# Altium schematic sheet POWER_BATT_REV2.SchDoc
size A4; SheetNumber: 2; SheetTotal: 11
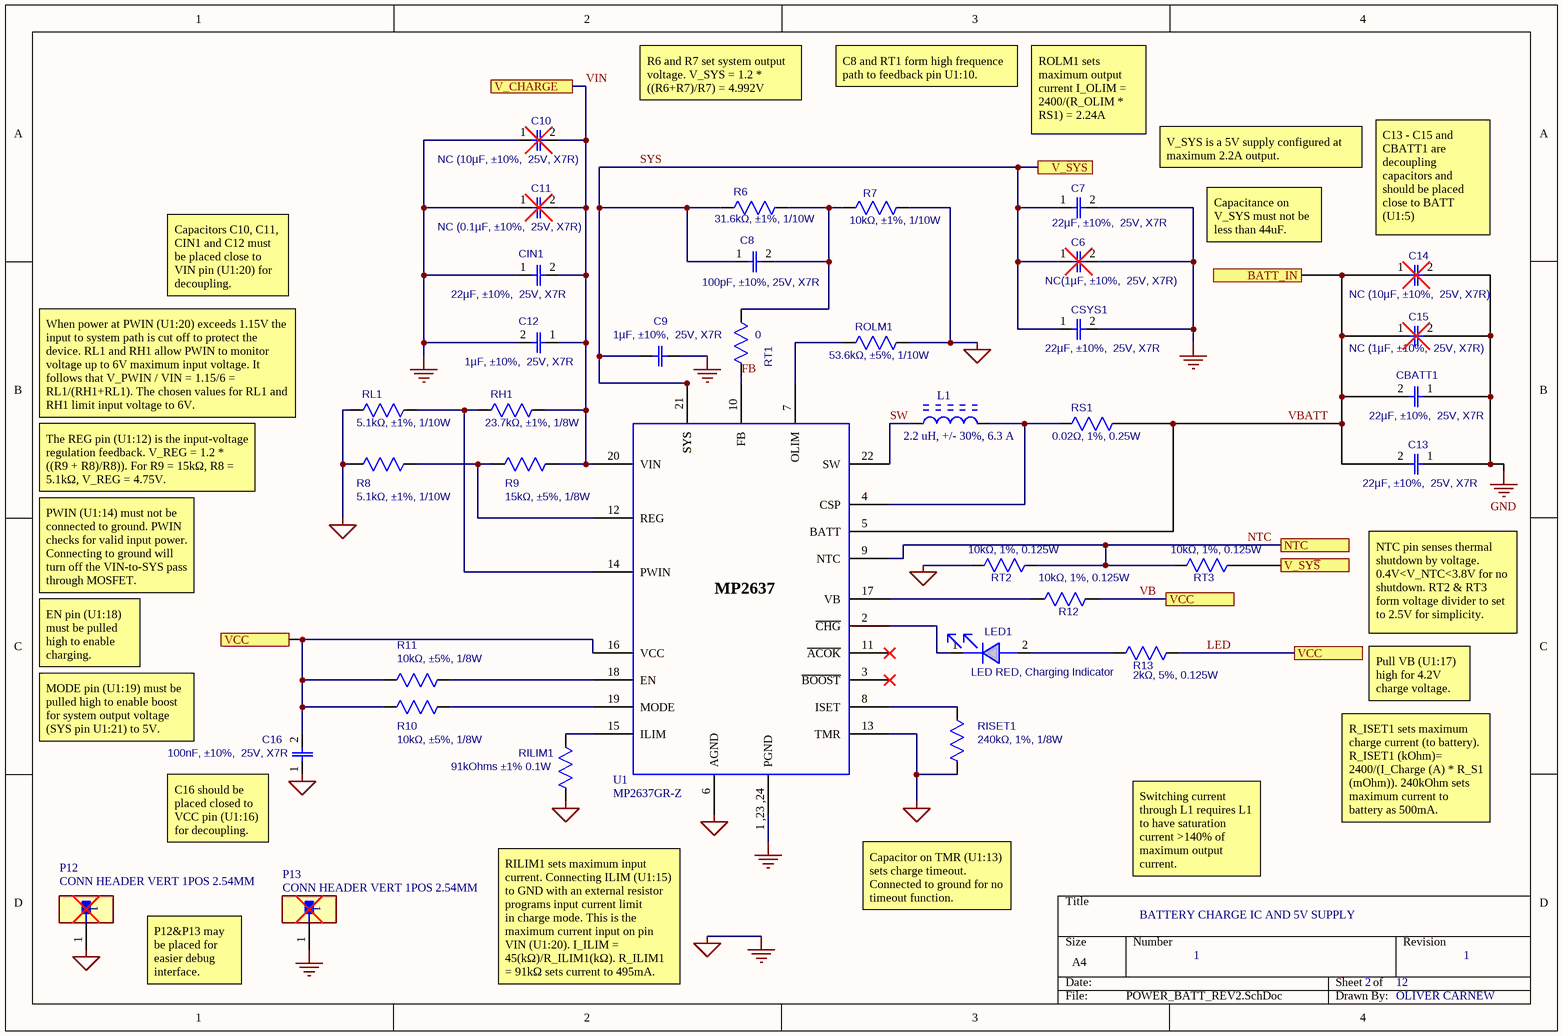
[diagram p0: POWER_BATT_REV2.SchDoc]

## Parts
(Parts that share a designator on the sheet are numbered #1, #2 ... from top to bottom, then left to right.)
*#1  NC  (value not drawn)
*#2  NC  (value not drawn)
*#3  NC  (value not drawn)
*?#1  NC  (value not drawn)
*?#2  NC  (value not drawn)
*?#3  NC  (value not drawn)
*?#4  NC  (value not drawn)
C6  NC(1µF, ±10%,  25V, X7R)  [CAP/0603]
C7  22µF, ±10%,  25V, X7R  [CAP/1206]
C8  100pF, ±10%, 25V, X7R  [CAP/0603]
C9  1µF, ±10%,  25V, X7R  [CAP/0603]
C10  NC (10µF, ±10%,  25V, X7R)  [CAP/0603]
C11  NC (0.1µF, ±10%,  25V, X7R)  [CAP/1206]
C12  1µF, ±10%,  25V, X7R  [CAP/0603]
C13  22µF, ±10%,  25V, X7R  [CAP/1206]
C14  NC (10µF, ±10%,  25V, X7R)  [CAP/0603]
C15  NC (1µF, ±10%,  25V, X7R)  [CAP/1206]
C16  100nF, ±10%,  25V, X7R  [CAP/0603]
CBATT1  22µF, ±10%,  25V, X7R  [CAP/1206]
CIN1  22µF, ±10%,  25V, X7R  [CAP/1206]
CSYS1  22µF, ±10%,  25V, X7R  [CAP/1206]
L1  2.2 uH, +/- 30%, 6.3 A  [BOUR-SRN8040_V]
LED1  LED RED, Charging Indicator  [LED/SMD/0805]
P12  CONN HEADER VERT 1POS 2.54MM  [FP-PH1-01-UA-MFG]
P13  CONN HEADER VERT 1POS 2.54MM  [FP-PH1-01-UA-MFG]
R6  31.6kΩ, ±1%, 1/10W  [RES/0603]
R7  10kΩ, ±1%, 1/10W  [RES/0603]
R8  5.1kΩ, ±1%, 1/10W  [RES/0603]
R9  15kΩ, ±5%, 1/8W  [RES/0603]
R10  10kΩ, ±5%, 1/8W  [RES/0603]
R11  10kΩ, ±5%, 1/8W  [RES/0603]
R12  10kΩ, 1%, 0.125W  [RES/0603]
R13  2kΩ, 5%, 0.125W  [RES/0603]
RH1  23.7kΩ, ±1%, 1/8W  [RES/0603]
RILIM1  91kOhms ±1% 0.1W  [RES/0603]
RISET1  240kΩ, 1%, 1/8W  [RES/0603]
RL1  5.1kΩ, ±1%, 1/10W  [RES/0603]
ROLM1  53.6kΩ, ±5%, 1/10W  [RES/0603]
RS1  0.02Ω, 1%, 0.25W  [RES/1206]
RT1  value 0  [RES/0603]  (hidden comment: RES/0603)
RT2  10kΩ, 1%, 0.125W  [RES/0603]
RT3  10kΩ, 1%, 0.125W  [RES/0603]
U1  MP2637GR-Z  [QFN24/4X4]

## Ports
BATT_IN, NTC, V_CHARGE, V_SYS, V_SY~{S}, VCC

## Nets
GND: C6.2 C7.2 C9.1 C10.1 C11.1 C12.2 C13.1 C14.2 C15.2 C16.1 CBATT1.1 CIN1.1 CSYS1.2 P12.1 P13.1 R7.1 R8.1 RILIM1.1 RISET1.1 RL1.1 ROLM1.1 RT2.2 U1.1_,23_,24(PGND) U1.6(AGND) U1.13(TMR)  [also labelled PGND]
FB: RT1.2 U1.10(FB)
LED: C16.2 R10.2 R11.2 R12.2 R13.1 U1.16(VCC) ; port VCC  [also labelled VB]
NTC: RT2.1 RT3.2 U1.9(NTC) ; port NTC
SW: L1.1 U1.22(SW)
SYS: C6.1 C7.1 C8.1 C9.2 CSYS1.1 R6.2 U1.21(SYS) U1.22(SYS) ; port V_SYS
V_SY~{S}: RT3.1 ; port V_SY~{S}
VBATT: C13.2 C14.1 C15.1 CBATT1.2 RS1.1 U1.5(BATT) ; port BATT_IN
VIN: C10.2 C11.2 C12.1 CIN1.2 R9.2 RH1.2 U1.20(VIN) ; port V_CHARGE
NetC8_2: C8.2 R6.1 R7.2 RT1.1
NetL1_2: L1.2 RS1.2 U1.4(CSP)
NetLED1_1: LED1.1 U1.2(~{CHG})
NetLED1_2: LED1.2 R13.2
NetR8_2: R8.2 R9.1 U1.12(REG)
NetR10_1: R10.1 U1.19(MODE)
NetR11_1: R11.1 U1.18(EN)
NetR12_1: R12.1 U1.17(VB)
NetRH1_1: RH1.1 RL1.2 U1.14(PWIN)
NetRILIM1_2: RILIM1.2 U1.15(ILIM)
NetRISET1_2: RISET1.2 U1.8(ISET)
NetROLM1_2: ROLM1.2 U1.7(OLIM)

Not connected (* = marked no-connect by the designer): U1 3(~{BOOST})* 11(~{ACOK})*

## Notes on the sheet
- R6 and R7 set system output voltage. V_SYS = 1.2 * ((R6+R7)/R7) = 4.992V
- C8 and RT1 form high frequence path to feedback pin U1:10.
- ROLM1 sets maximum output current I_OLIM = 2400/(R_OLIM * RS1) = 2.24A
- V_SYS is a 5V supply configured at maximum 2.2A output.
- Capacitance on V_SYS must not be less than 44uF.
- C13 - C15 and CBATT1 are decoupling capacitors and should be placed close to BATT (U1:5)
- Capacitors C10, C11, CIN1 and C12 must be placed close to VIN pin (U1:20) for decoupling.
- When power at PWIN (U1:20) exceeds 1.15V the input to system path is cut off to protect the device. RL1 and RH1 allow PWIN to monitor voltage up to 6V maximum input voltage. It follows that V_PWIN / VIN = 1.15/6 = RL1/(RH1+RL1). The chosen values for RL1 and RH1 limit input voltage to 6V.
- The REG pin (U1:12) is the input-voltage regulation feedback. V_REG = 1.2 * ((R9 + R8)/R8)). For R9 = 15kΩ, R8 = 5.1kΩ, V_REG = 4.75V.
- PWIN (U1:14) must not be connected to ground. PWIN checks for valid input power. Connecting to ground will turn off the VIN-to-SYS pass through MOSFET.
- NTC pin senses thermal shutdown by voltage. 0.4V<V_NTC<3.8V for no shutdown. RT2 & RT3 form voltage divider to set to 2.5V for simplicity.
- EN pin (U1:18) must be pulled high to enable charging.
- Pull VB (U1:17) high for 4.2V charge voltage.
- MODE pin (U1:19) must be pulled high to enable boost for system output voltage (SYS pin U1:21) to 5V.
- (near C16) C16 should be placed closed to VCC pin (U1:16) for decoupling.
- R_ISET1 sets maximum charge current (to battery). R_ISET1 (kOhm)= 2400/(I_Charge (A) * R_S1 (mOhm)). 240kOhm sets maximum current to battery as 500mA.
- Capacitor on TMR (U1:13) sets charge timeout. Connected to ground for no timeout function.
- Switching current through L1 requires L1 to have saturation current >140% of maximum output current.
- BATTERY CHARGE IC AND 5V SUPPLY
- P12&P13 may be placed for easier debug interface.
- RILIM1 sets maximum input current. Connecting ILIM (U1:15) to GND with an external resistor programs input current limit
  in charge mode. This is the maximum current input on pin VIN (U1:20). I_ILIM = 45(kΩ)/R_ILIM1(kΩ). R_ILIM1 = 91kΩ sets current to 495mA.
- 1
- 2
- 12
- OLIVER CARNEW

## Library data of the parts
C6 = 07.0043: Ceramic Capacitor;16V;X7R;0603;; Manufacturer: {Manufacturer}; Manufacturer P/N: {Manufacturer P/N}; Part_Name: GRM188R71C105KA12D; Manufacture: muRata; Pid: 1505; Out_Num: 0; Available_Num: 5801; Note: 1uF/16V; Package: 0603; Part Number: 07.0043; Spec: Ceramic Capacitor; Manufacture_PN: GRM188R71C105KA12D; Stock_Num: 5801
C7 C15 CSYS1 = 07.0581: Ceramic Capacitor;10V;X7R;1206; Manufacturer: {Manufacturer}; Manufacturer P/N: {Manufacturer P/N}; Part_Name: GRM31CR71A226KE15L; Manufacture: muRata; Pid: 2003; Out_Num: 0; Available_Num: 1278; Note: 22uF/10V/1206; Package: 1206; Part Number: 07.0581; Spec: Ceramic Capacitor; Manufacture_PN: GRM31CR71A226KE15L; Stock_Num: 1278
C8 = 07.0138: Ceramic Capacitor;50V;C0G;0603; 100pF; Manufacturer: {Manufacturer}; Manufacturer P/N: {Manufacturer P/N}; Part_Name: C1608C0G1H470J; Manufacture: TDK; Pid: 1600; Out_Num: 0; Available_Num: 5335; Note: 47pF/50V; Package: 0603; Part Number: 07.0138; Spec: Ceramic Capacitor; Manufacture_PN: C1608C0G1H470J; Stock_Num: 5335
C9 = 07.0043: Ceramic Capacitor;16V;X7R;0603;; Manufacturer: {Manufacturer}; Manufacturer P/N: {Manufacturer P/N}; Part_Name: GRM188R71C105KA12D; Manufacture: muRata; Pid: 680; Out_Num: 0; Available_Num: 2297; Package: 0603; Part Number: 07.0043; Spec: Ceramic Capacitor; Manufacture_PN: GRM188R71C105KA12D; Stock_Num: 2297
C10 = 07.0772: Ceramic Capacitor;25V;X7R; Manufacturer: {Manufacturer}; Manufacturer P/N: {Manufacturer P/N}; Part_Name: C1608X7R1E105K; Manufacture: TDK; Pid: 2193; Out_Num: 310; Available_Num: 2930; Note: 1uF/25V; Package: 0603; Part Number: 07.0772; Spec: Ceramic Capacitor; Manufacture_PN: C1608X7R1E105K; Stock_Num: 3240
C11 CIN1 = 07.0752: Ceramic Capacitor;25V;X5R;; Manufacturer: {Manufacturer}; Manufacturer P/N: {Manufacturer P/N}; Part_Name: GRM31CR61E226KE15; Manufacture: Murata; Pid: 2173; Out_Num: 260; Available_Num: 1967; Note: 22uF/25V/1206; Package: 1206; Part Number: 07.0752; Spec: Ceramic Capacitor; Manufacture_PN: GRM31CR61E226KE15; Stock_Num: 2227
C12 = 07.0772: Ceramic Capacitor;25V;X7R; Manufacturer: {Manufacturer}; Manufacturer P/N: {Manufacturer P/N}; Part_Name: C1608X7R1E105K; Manufacture: TDK; Pid: 2193; Out_Num: 0; Note: 1uF/25V; Package: 0603; Part Number: 07.0772; Spec: Ceramic Capacitor; Manufacture_PN: C1608X7R1E105K; Stock_Num: 0; Available_Num: 0
C13 = 07.0581: Ceramic Capacitor;10V;X7R;1206; 22µF, ±10%,  25V, X7R; Manufacturer: {Manufacturer}; Manufacturer P/N: {Manufacturer P/N}; Part_Name: GRM31CR71A226KE15L; Manufacture: muRata; Pid: 1170; Out_Num: 0; Available_Num: 1278; Package: 1206; Part Number: 07.0581; Spec: Ceramic Capacitor; Manufacture_PN: GRM31CR71A226KE15L; Stock_Num: 1278
C14 = 07.0043: Ceramic Capacitor;16V;X7R;0603; NC (22µF, ±10%,  25V, X7R); Manufacturer: {Manufacturer}; Manufacturer P/N: {Manufacturer P/N}; Part_Name: GRM188R71C105KA12D; Manufacture: muRata; Pid: 1505; Out_Num: 0; Available_Num: 5801; Note: 1uF/16V; Package: 0603; Part Number: 07.0043; Spec: Ceramic Capacitor; Manufacture_PN: GRM188R71C105KA12D; Stock_Num: 5801
C16 = 07.0053: Ceramic Capacitor;16V;X7R;0603;100nF, ±10%,  25V, X7R; Manufacturer: {Manufacturer}; Manufacturer P/N: {Manufacturer P/N}; Part_Name: GRM188R71C104KA01D; Manufacture: muRata; Pid: 1515; Out_Num: 1670; Available_Num: 848; Note: 100nF/16V; Package: 0603; Part Number: 07.0053; Spec: Ceramic Capacitor; Manufacture_PN: GRM188R71C104KA01D; Stock_Num: 2518
CBATT1 = 07.0581: Ceramic Capacitor;10V;X7R;1206; Manufacturer: {Manufacturer}; Manufacturer P/N: {Manufacturer P/N}; Part_Name: GRM31CR71A226KE15L; Manufacture: muRata; Pid: 1170; Out_Num: 0; Available_Num: 1278; Package: 1206; Part Number: 07.0581; Spec: Ceramic Capacitor; Manufacture_PN: GRM31CR71A226KE15L; Stock_Num: 1278
L1 = CMP-2000-07144-1: Semi-Shielded Power Inductor, 2.2 uH, +/- 30%, 6.3 A, -40 to 125 degC, 2-Pin SMD, RoHS, Tape and Reel SRN8040-2R2Y; Manufacturer: Bourns; Brand/Series: SRN8040Series; Current, Rating: 6.3A; Inductance: 2.2μH; Type: Power; Datasheet Version: 05/2015; Mounting Technology: SurfaceMount; Tolerance: ±30%; Datasheet URL: http://www.bourns.com/docs/Product-Datasheets/SRN8040.pdf; Package Reference: SRN8040; Termination: SMD; Manufacturer URL: http://www.bourns.com/; Package Description: 2-Pin Surface Mounted Device, Body 8 x 8 mm
LED1 = 19.0003: LED;ºì¹â; LED/SMD/0805; Manufacturer P/N: {Manufacturer P/N}; Manufacturer: {Manufacturer}; Manufacture: BRIGHT LED; Value: BL-HUF35A-TRB; Pid: 37; Out_Num: 0; Available_Num: 1960; Package: 0805; Part Number: 19.0003; Spec: LED; Part_Name: BL-HUF35A-TRB; Manufacture_PN: BL-HUF35A-TRB; Stock_Num: 1960
P12 P13 = CMP-42765-000003-1: CONN HEADER VERT 1POS 2.54MM PH1-01-UA; Number of Positions: 1; Voltage Rating (AC): 250V; Insulation Material: PBT; Number of Rows: 1; Connector Type: Header; Min Operating Temperature: -40°C; Packaging: Bulk; Contact Material: Brass; Mount: Through Hole; Contact Shape: Square; Contact Finish - Mating: GOLD; Series: PH1; Contact Type: Male Pin; Termination: Solder; Flammability Rating: UL94 V-0; Insulation Color: Black; Lead Free: Lead Free; Fastening Type: Pull; Max Operating Temperature: 105°C
R6 = 06.0160: Film Resistor;1%;; Manufacturer: Yageo; Manufacturer P/N: 9C06031A1203FKHFT; Part_Name: RC0603FR-0731K6L; Pid: 2840; Out_Num: 0; Available_Num: 4254; Note: 31.6k/1%; Distributor: Digikey; Package: 0603; Distributor P/N: 311-120KHCT-ND; Part Number: 06.0160; Spec: Film Resistor; Manufacture: Yageo; Manufacture_PN: RC0603FR-0731K6L; Stock_Num: 4254
R7 = 06.0112: Film Resistor;1%;; Manufacturer: Yageo; Manufacturer P/N: 9C06031A1203FKHFT; Part_Name: RC0603FR-0710KL; Pid: 2792; Out_Num: 2310; Available_Num: 7415; Note: 10k/1%; Distributor: Digikey; Package: 0603; Distributor P/N: 311-120KHCT-ND; Part Number: 06.0112; Spec: Film Resistor; Manufacture: Yageo; Manufacture_PN: RC0603FR-0710KL; Stock_Num: 9725
R8 RL1 = 06.0691: Film Resistor;1%;; Manufacturer: Yageo; Manufacturer P/N: 9C06031A1203FKHFT; Part_Name: RC0603FR-075K1L; Pid: 3353; Out_Num: 0; Available_Num: 5749; Note: 5.1k/1%; Distributor: Digikey; Package: 0603; Distributor P/N: 311-120KHCT-ND; Part Number: 06.0691; Spec: Film Resistor; Manufacture: Yageo; Manufacture_PN: RC0603FR-075K1L; Stock_Num: 5749
R9 = 06.0129: Film Resistor;1%;; Manufacturer: Yageo; Manufacturer P/N: 9C06031A1203FKHFT; Part_Name: RC0603FR-0715KL; Pid: 2809; Out_Num: 160; Available_Num: 3939; Note: 15k/1%; Distributor: Digikey; Package: 0603; Distributor P/N: 311-120KHCT-ND; Part Number: 06.0129; Spec: Film Resistor; Manufacture: Yageo; Manufacture_PN: RC0603FR-0715KL; Stock_Num: 4099
R10 = 06.0284: Film Resistor;5%;; Manufacturer: Yageo; Manufacturer P/N: 9C06031A1203FKHFT; Part_Name: RC0603JR-0710K; Pid: 2947; Out_Num: 0; Available_Num: 6218; Note: 10k; Distributor: Digikey; Package: 0603; Distributor P/N: 311-120KHCT-ND; Part Number: 06.0284; Spec: Film Resistor; Manufacture: Yageo; Manufacture_PN: RC0603JR-0710K; Stock_Num: 6218
R11 = 06.0284: Manufacturer: Yageo; Manufacturer P/N: 9C06031A1203FKHFT; Part_Name: RC0603JR-0710K; Pid: 2947; Spec: Film Resistor; Out_Num: 0; Available_Num: 6218; Note: 10k; Distributor: Digikey; Package: 0603; Distributor P/N: 311-120KHCT-ND; Part Number: 06.0284; Manufacture: Yageo; Manufacture_PN: RC0603JR-0710K; Stock_Num: 6218
R12 = 06.0284: Film Resistor;5%; 10kΩ, 1%, 0.125W; 0603; Manufacturer: Yageo; Manufacturer P/N: 9C06031A1203FKHFT; Part_Name: RC0603JR-0710K; Pid: 2947; Out_Num: 0; Available_Num: 6218; Note: 10k; Distributor: Digikey; Package: 0603; Distributor P/N: 311-120KHCT-ND; Part Number: 06.0284; Spec: Film Resistor; Manufacture: Yageo; Manufacture_PN: RC0603JR-0710K; Stock_Num: 6218
R13 = 06.0015: Film Resistor;5%;1/10W; 5kΩ, 5%, 0.125W 0603; Manufacturer: Yageo; Manufacturer P/N: 9C06031A1203FKHFT; Part_Name: CR0603JA0202G; Manufacture: LIZ; Pid: 2695; Out_Num: 0; Available_Num: 3523; Note: 2K; Distributor: Digikey; Package: 0603; Distributor P/N: 311-120KHCT-ND; Part Number: 06.0015; Spec: Film Resistor; Manufacture_PN: CR0603JA0202G; Stock_Num: 3523
RH1 = 06.0148: Film Resistor;1%; Manufacturer: Yageo; Manufacturer P/N: 9C06031A1203FKHFT; Part_Name: RC0603FR-0723K7L; Pid: 2828; Out_Num: 0; Available_Num: 7686; Note: 23.7k/1%; Distributor: Digikey; Package: 0603; Distributor P/N: 311-120KHCT-ND; Part Number: 06.0148; Spec: Film Resistor; Manufacture: Yageo; Manufacture_PN: RC0603FR-0723K7L; Stock_Num: 7686
RILIM1 = 06.0129: 91 kOhms ±1% 0.1W, 1/10W Chip Resistor 0603 (1608 Metric) Anti-Sulfur Thin FilmMCT06030C9102FP500; Manufacturer: Yageo; Manufacturer P/N: 9C06031A1203FKHFT; Part_Name: RC0603FR-0715KL; Value: 15K 1%; Pid: 2809; Spec: Film Resistor; Out_Num: 0; Available_Num: 1229; Note: 15k/1%; Distributor: Digikey; Package: 0603; Distributor P/N: 311-120KHCT-ND; Part Number: 06.0129; Manufacture: Yageo; Manufacture_PN: RC0603FR-0715KL; Stock_Num: 1229
RISET1 = 06.0177: Film Resistor;1%; 240kΩ, 1%, 1/8W; Manufacturer: Yageo; Manufacturer P/N: 9C06031A1203FKHFT; Part_Name: RC0603FR-0747K5L; Pid: 2857; Out_Num: 0; Available_Num: 7700; Note: 47.5k/1%; Distributor: Digikey; Package: 0603; Distributor P/N: 311-120KHCT-ND; Part Number: 06.0177; Spec: Film Resistor; Manufacture: Yageo; Manufacture_PN: RC0603FR-0747K5L; Stock_Num: 7700
ROLM1 = 06.0182: Film Resistor;1%; Manufacturer: Yageo; Manufacturer P/N: 9C06031A1203FKHFT; Part_Name: RC0603FR-0753K6L; Pid: 2862; Out_Num: 0; Available_Num: 9040; Note: 53.6k/1%; Distributor: Digikey; Package: 0603; Distributor P/N: 311-120KHCT-ND; Part Number: 06.0182; Spec: Film Resistor; Manufacture: Yageo; Manufacture_PN: RC0603FR-0753K6L; Stock_Num: 9040
RS1 = 06.0564: Film Resistor;1%; RES 0.02 OHM 1% 1/4W 1206; WSL1206R0200FEA; Manufacturer: Yageo; Manufacturer P/N: 9C06031A1203FKHFT; Part_Name: WSL1206-18; Manufacture: Vishay; Pid: 3227; Out_Num: 0; Available_Num: 291; Note: 20m/1%/1206; Distributor: Digikey; Package: 1206; Distributor P/N: 311-120KHCT-ND; Part Number: 06.0564; Spec: Film Resistor; Manufacture_PN: WSL1206-18; Stock_Num: 291
RT1 = 06.0039: Film Resistor;5%;; Manufacturer: Yageo; Manufacturer P/N: 9C06031A1203FKHFT; Part_Name: RC0603JR-070RL; Pid: 2719; Out_Num: 4670; Available_Num: 14667; Distributor: Digikey; Package: 0603; Distributor P/N: 311-120KHCT-ND; Part Number: 06.0039; Spec: Film Resistor; Manufacture: Yageo; Manufacture_PN: RC0603JR-070RL; Stock_Num: 19337; Note: 0
RT2 = 06.0112: Film Resistor;1%; 10kΩ, 1%, 0.125W; 0603; Manufacturer: Yageo; Manufacturer P/N: 9C06031A1203FKHFT; Part_Name: RC0603FR-0710KL; Pid: 2792; Out_Num: 2110; Available_Num: 16838; Note: 10k/1%; Distributor: Digikey; Package: 0603; Distributor P/N: 311-120KHCT-ND; Part Number: 06.0112; Spec: Film Resistor; Manufacture: Yageo; Manufacture_PN: RC0603FR-0710KL; Stock_Num: 18948
RT3 = 06.0112: Film Resistor;1%; 10kΩ, 1%, 0.125W;0603; Manufacturer: Yageo; Manufacturer P/N: 9C06031A1203FKHFT; Part_Name: RC0603FR-0710KL; Pid: 2792; Out_Num: 2110; Available_Num: 16838; Note: 10k/1%; Distributor: Digikey; Package: 0603; Distributor P/N: 311-120KHCT-ND; Part Number: 06.0112; Spec: Film Resistor; Manufacture: Yageo; Manufacture_PN: RC0603FR-0710KL; Stock_Num: 18948
U1 = MP2637